# Altium schematic sheet Rx_micro.SchDoc: Balise IR-Rx - Controleur
size A3; Author: B Labbe; CompanyName: Oufffteam; DrawnBy: B Labbe; Engineer: B Labbe; Organization: Oufffteam; Address1: L3, 12a Rodborough Rd; Address2: Frenchs Forest; Address3: NSW; Address4: Australia 2086; Revision: B; SheetNumber: 2; SheetTotal: 5; DocumentName: Balise IR-Rx - Controleur
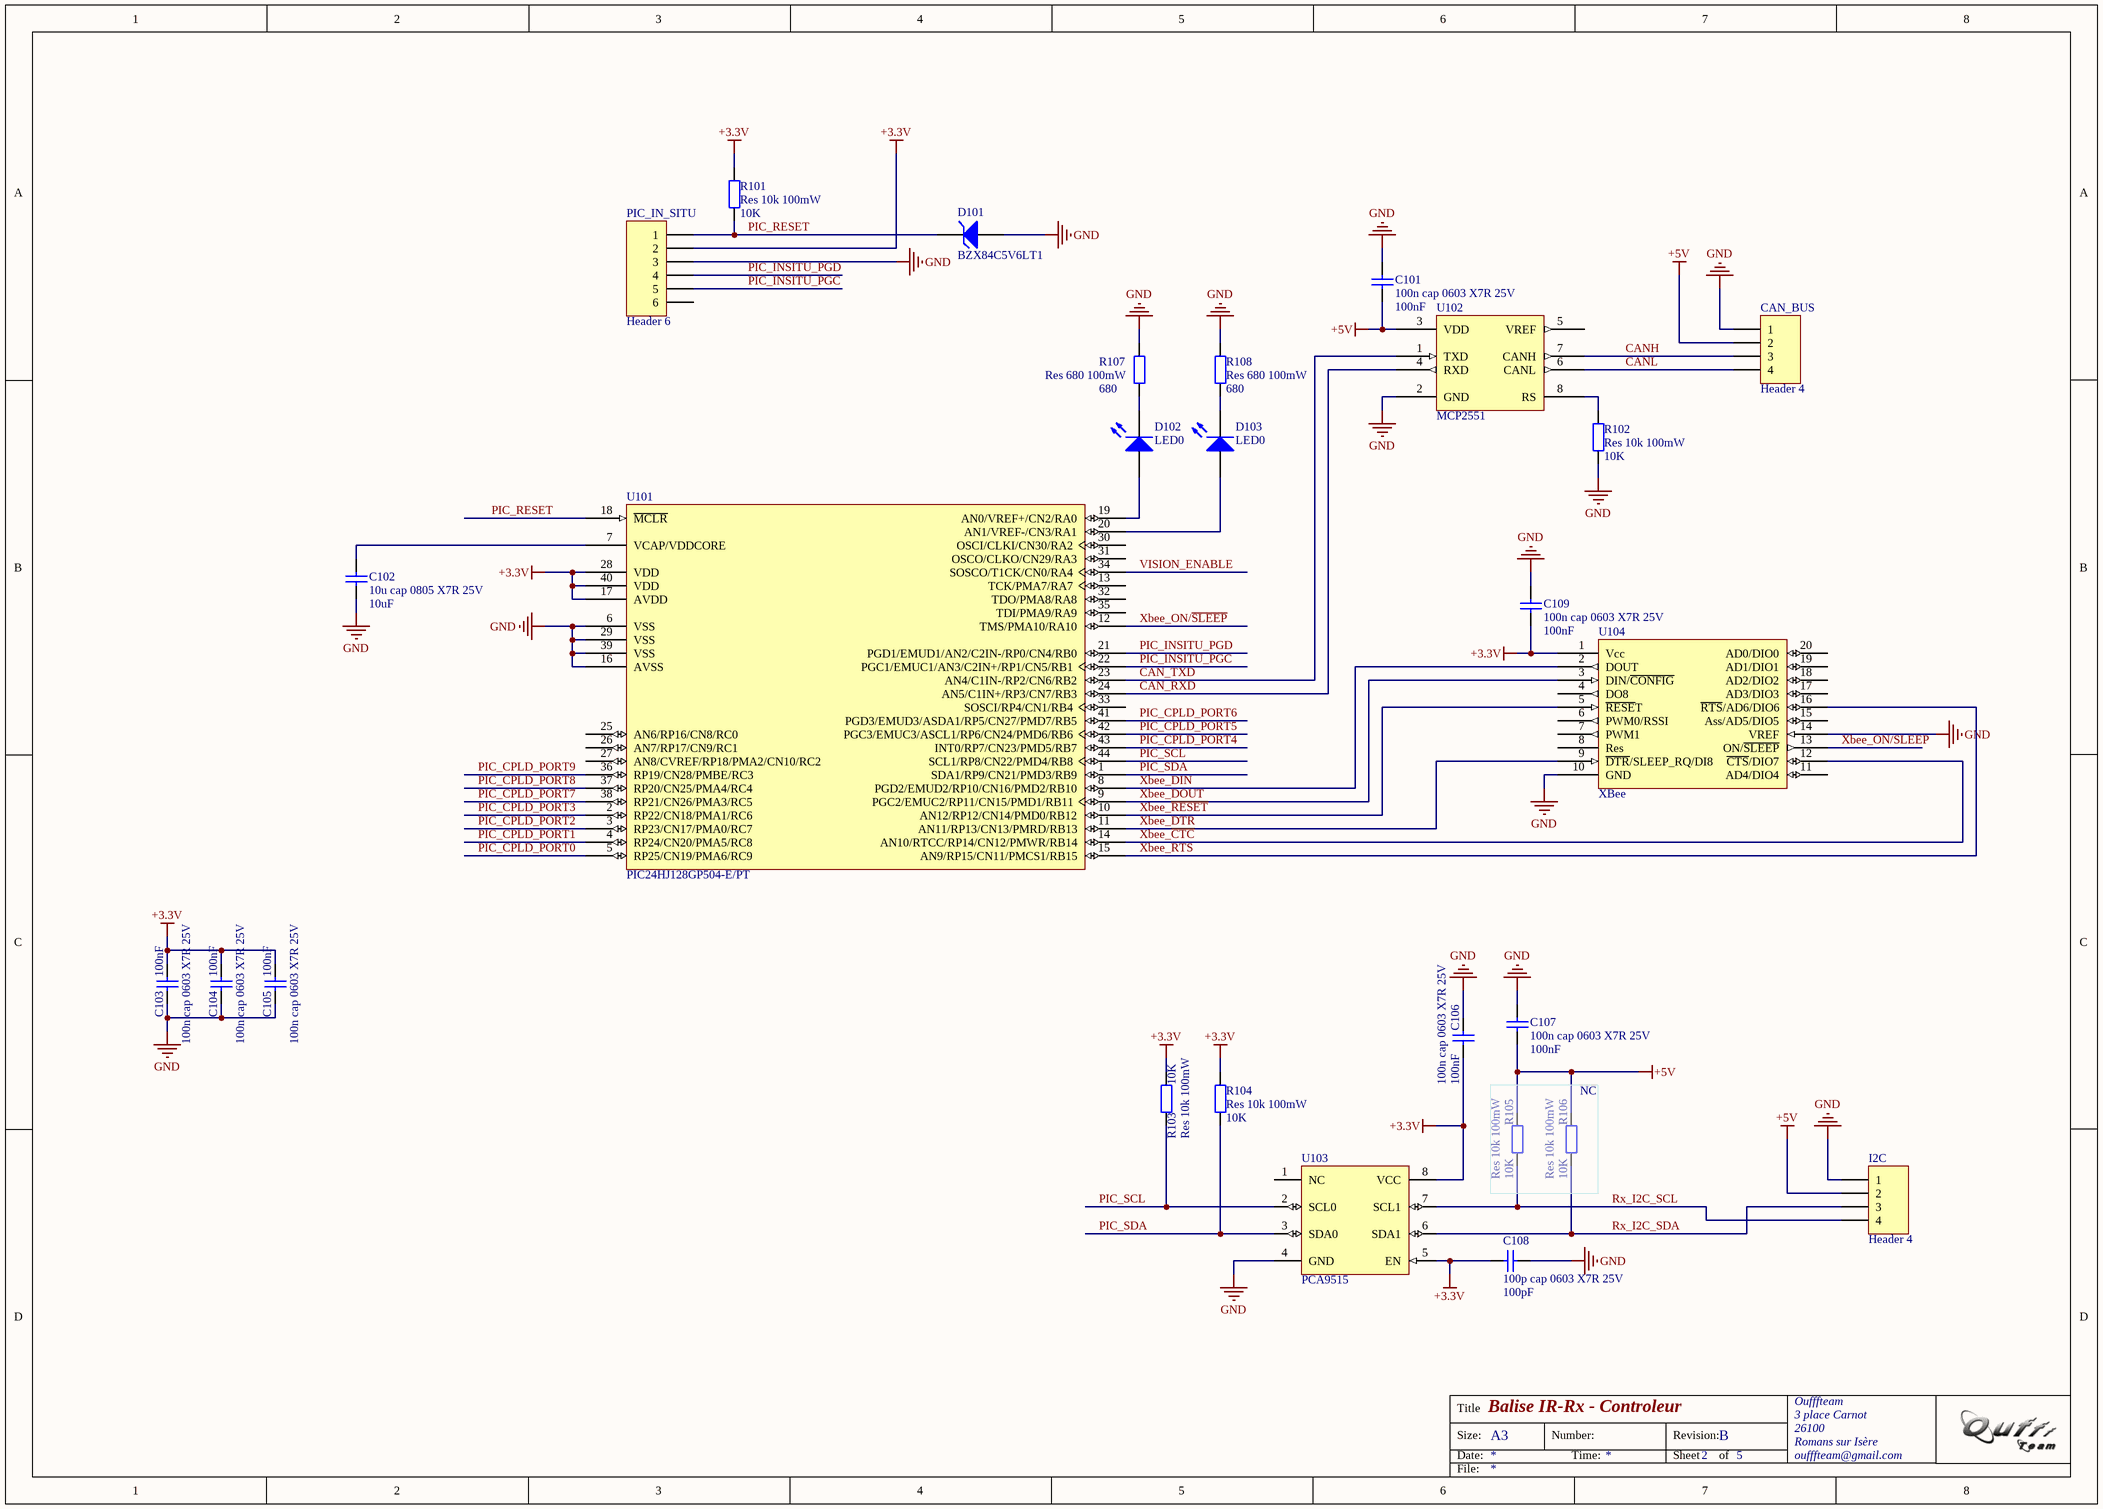
[diagram p0: Rx_micro.SchDoc]

## Parts
C101  100n cap 0603 X7R 25V  value 100nF  [0603]
C102  10u cap 0805 X7R 25V  value 10uF  [0805]
C103  100n cap 0603 X7R 25V  value 100nF  [0603]
C104  100n cap 0603 X7R 25V  value 100nF  [0603]
C105  100n cap 0603 X7R 25V  value 100nF  [0603]
C106  100n cap 0603 X7R 25V  value 100nF  [1608[0603]]
C107  100n cap 0603 X7R 25V  value 100nF  [1608[0603]]
C108  100p cap 0603 X7R 25V  value 100pF  [1608[0603]]
C109  100n cap 0603 X7R 25V  value 100nF  [0603]
CAN_BUS  Header 4  [HDR1X4]
D101  BZX84C5V6LT1  [318-07]
D102  LED0  [0603]
D103  LED0  [0603]
I2C  Header 4  [HDR1X4]
PIC_IN_SITU  Header 6  [HDR1X6]
R101  Res 10k 100mW  value 10K  [0603]
R102  Res 10k 100mW  value 10K  [0603]
R103  Res 10k 100mW  value 10K  [0603]
R104  Res 10k 100mW  value 10K  [0603]
R105  Res 10k 100mW  value 10K  [1608[0603]]
R106  Res 10k 100mW  value 10K  [1608[0603]]
R107  Res 680 100mW  value 680  [0603]
R108  Res 680 100mW  value 680  [0603]
U101  PIC24HJ128GP504-E/PT  [TQFP-PT44_N]
U102  MCP2551  [SOIC150-8_N]
U103  PCA9515  [TSSOP-8]
U104  XBee  [XBee_SM]

## Nets
+3.3V: C103.2 C104.2 C105.2 C106.1 C108.2 C109.1 PIC_IN_SITU.2 R101.2 R103.2 R104.2 U101.17(AVDD) U101.28(VDD) U101.40(VDD) U103.5(EN) U103.8(VCC) U104.1(Vcc)
+5V: C101.1 C107.2 CAN_BUS.2 I2C.2 R105.2 R106.2 U102.3(VDD)
GND: C101.2 C102.1 C103.1 C104.1 C105.1 C106.2 C107.1 C108.1 C109.2 CAN_BUS.1 D101.1(A) I2C.1 PIC_IN_SITU.3 R102.1 R107.2 R108.2 U101.6(VSS) U101.16(AVSS) U101.29(VSS) U101.39(VSS) U102.2(GND) U103.4(GND) U104.10(GND) U104.14(VREF)
CAN_RXD: U101.24(AN5/C1IN+/RP3/CN7/RB3) U102.4(RXD)
CAN_TXD: U101.23(AN4/C1IN-/RP2/CN6/RB2) U102.1(TXD)
CANH: CAN_BUS.3 U102.7(CANH)
CANL: CAN_BUS.4 U102.6(CANL)
PIC_CPLD_PORT0: U101.5(RP25/CN19/PMA6/RC9)
PIC_CPLD_PORT1: U101.4(RP24/CN20/PMA5/RC8)
PIC_CPLD_PORT2: U101.3(RP23/CN17/PMA0/RC7)
PIC_CPLD_PORT3: U101.2(RP22/CN18/PMA1/RC6)
PIC_CPLD_PORT4: U101.43(INT0/RP7/CN23/PMD5/RB7)
PIC_CPLD_PORT5: U101.42(PGC3/EMUC3/ASCL1/RP6/CN24/PMD6/RB6)
PIC_CPLD_PORT6: U101.41(PGD3/EMUD3/ASDA1/RP5/CN27/PMD7/RB5)
PIC_CPLD_PORT7: U101.38(RP21/CN26/PMA3/RC5)
PIC_CPLD_PORT8: U101.37(RP20/CN25/PMA4/RC4)
PIC_CPLD_PORT9: U101.36(RP19/CN28/PMBE/RC3)
PIC_INSITU_PGC: PIC_IN_SITU.5 U101.22(PGC1/EMUC1/AN3/C2IN+/RP1/CN5/RB1)
PIC_INSITU_PGD: PIC_IN_SITU.4 U101.21(PGD1/EMUD1/AN2/C2IN-/RP0/CN4/RB0)
PIC_RESET: D101.3(K) PIC_IN_SITU.1 R101.1 U101.18(~{MCLR})
PIC_SCL: R103.1 U101.44(SCL1/RP8/CN22/PMD4/RB8) U103.2(SCL0)
PIC_SDA: R104.1 U101.1(SDA1/RP9/CN21/PMD3/RB9) U103.3(SDA0)
Rx_I2C_SCL: I2C.4 R105.1 U103.7(SCL1)
Rx_I2C_SDA: I2C.3 R106.1 U103.6(SDA1)
VISION_ENABLE: U101.34(SOSCO/T1CK/CN0/RA4)
Xbee_~{CTC}: U101.14(AN10/RTCC/RP14/CN12/PMWR/RB14) U104.12(~{CTS}/DIO7)
Xbee_DIN: U101.8(PGD2/EMUD2/RP10/CN16/PMD2/RB10) U104.2(DOUT)
Xbee_DOUT: U101.9(PGC2/EMUC2/RP11/CN15/PMD1/RB11) U104.3(DIN/~{CONFIG})
Xbee_DTR: U101.11(AN11/RP13/CN13/PMRD/RB13) U104.9(~{DTR}/SLEEP_RQ/DI8)
Xbee_ON/~{SLEEP}: U101.12(TMS/PMA10/RA10) U104.13(ON/~{SLEEP})
Xbee_~{RESET}: U101.10(AN12/RP12/CN14/PMD0/RB12) U104.5(~{RESE}T)
Xbee_~{RTS}: U101.15(AN9/RP15/CN11/PMCS1/RB15) U104.16(~{RTS}/AD6/DIO6)
NetC102_2: C102.2 U101.7(VCAP/VDDCORE)
NetD102_1: D102.1(A) U101.19(AN0/VREF+/CN2/RA0)
NetD102_2: D102.2(K) R107.1
NetD103_1: D103.1(A) U101.20(AN1/VREF-/CN3/RA1)
NetD103_2: D103.2(K) R108.1
NetR102_2: R102.2 U102.8(RS)

Not connected (* = marked no-connect by the designer): PIC_IN_SITU 6; U101 13(TCK/PMA7/RA7) 25(AN6/RP16/CN8/RC0) 26(AN7/RP17/CN9/RC1) 27(AN8/CVREF/RP18/PMA2/CN10/RC2) 30(OSCI/CLKI/CN30/RA2) 31(OSCO/CLKO/CN29/RA3) 32(TDO/PMA8/RA8) 33(SOSCI/RP4/CN1/RB4) 35(TDI/PMA9/RA9); U102 5(VREF); U103 1(NC); U104 4(DO8) 6(PWM0/RSSI) 7(PWM1) 8(Res) 11(AD4/DIO4) 15(Ass/AD5/DIO5) 17(AD3/DIO3) 18(AD2/DIO2) 19(AD1/DIO1) 20(AD0/DIO0)

## Notes on the sheet
- (near R106) NC
- Title
- Size:
- Date:
- A3
- Number:
- Time:
- Revision:
- Sheet
- of
- Oufffteam
- 3 place Carnot
- 26100
- Romans sur Isère
- oufffteam@gmail.com
- File:

## Library data of the parts
C101-C109 = Cap: Capacitor; Published: 8-Jun-2000; LatestRevisionDate: 17-Jul-2002; LatestRevisionNote: Re-released for DXP Platform.; PackageReference: RAD-0.3; Publisher: Altium Limited
CAN_BUS I2C = Header 4: Header, 4-Pin; LatestRevisionDate: 17-Jul-2002; LatestRevisionNote: Re-released for DXP Platform.; Publisher: Altium Limited
D101 = BZX84C5V6LT1: Zener Voltage Regulator Diode; Note: Pin 2 is not connected and not drawn.; Published: 29-Sep-2000; LatestRevisionDate: 17-Jul-2002; LatestRevisionNote: Re-released for DXP Platform.; PackageReference: 318-07; Publisher: Altium Limited; PackageDescription: SOT-23; 3 Leads; Body 3.0 x 2.5 mm, inc. leads (LxW max); ComponentLink1Description: Manufacturer Link; ComponentLink1URL: http://www.onsemi.com/site/products/landing?taxonomyID=194; ComponentLink2Description: Datasheet; ComponentLink2URL: http://www.onsemi.com/pub/Collateral/BZX84C2V4LT1-D.PDF
D102 D103 = LED0: 0603 Led; Published: 8-Jun-2000; LatestRevisionDate: 08-Jul-2005; LatestRevisionNote: Mech Layer 1 removed.; PackageReference: LED-0; Publisher: Altium Limited
PIC_IN_SITU = Header 6: Header, 6-Pin; LatestRevisionDate: 17-Jul-2002; LatestRevisionNote: Re-released for DXP Platform.; Publisher: Altium Limited
R101-R108 = Res2: Resistor; Published: 8-Jun-2000; LatestRevisionDate: 17-Jul-2002; LatestRevisionNote: Re-released for DXP Platform.; PackageReference: AXIAL-0.4; Publisher: Altium Limited
U101 = PIC24HJ128GP504-E/PT: High Speed General Purpose 16-Bit Flash Microcontroller, 128KB Flash, 8KB RAM, 44-Pin TQFP, Extended Temperature; Published: 29-Jan-2009; DatasheetVersion: revB, Mar-2008; PackageVersion: revAW, Oct-2008; PackageReference: TQFP-PT44; Publisher: Altium Limited; PackageDescription: 44-Lead Plastic Thin Quad Flatpack (PT) - 10x10x1mm Body, 2.00mm [TQFP]; Code_JEDEC: MS-026; ComponentLink1Description: Manufacturer Link; ComponentLink1URL: http://www.microchip.com; ComponentLink2Description: Datasheet; ComponentLink2URL: http://ww1.microchip.com/downloads/en/DeviceDoc/70293B.pdf; ComponentLink3Description: Packaging Specification; ComponentLink3URL: http://ww1.microchip.com/downloads/en/PackagingSpec/00049AW.pdf
U102 = MCP2551: High Speed Can Transceiver; Published: 6-Oct-2005; LatestRevisionDate: 13-Apr-2006; LatestRevisionNote: IPC-7351 Footprint Added.; DatasheetVersion: Nov-2003; PackageVersion: Oct-2005; PackageReference: SOIC150-8; Publisher: Altium Limited; PackageDescription: 8-Pin Plastic Narrow Body Small Outline Integrated Circuit 1.27 mm Pitch; Code_JEDEC: MS-012; ComponentLink1Description: Manufacturer Link; ComponentLink1URL: http://www.microchip.com; ComponentLink2Description: Datasheet; ComponentLink2URL: http://ww1.microchip.com/downloads/en/DeviceDoc/21667d.pdf
U103 = PCA9515: DUAL BIDIRECTIONAL I2C BUS AND SMBus REPEATER
U104 = XBee: OEM RF Modules